# EAGLE design SparkFun_Cryptographic_Co-processor_ATECC608A (EAGLE 9.6.2)
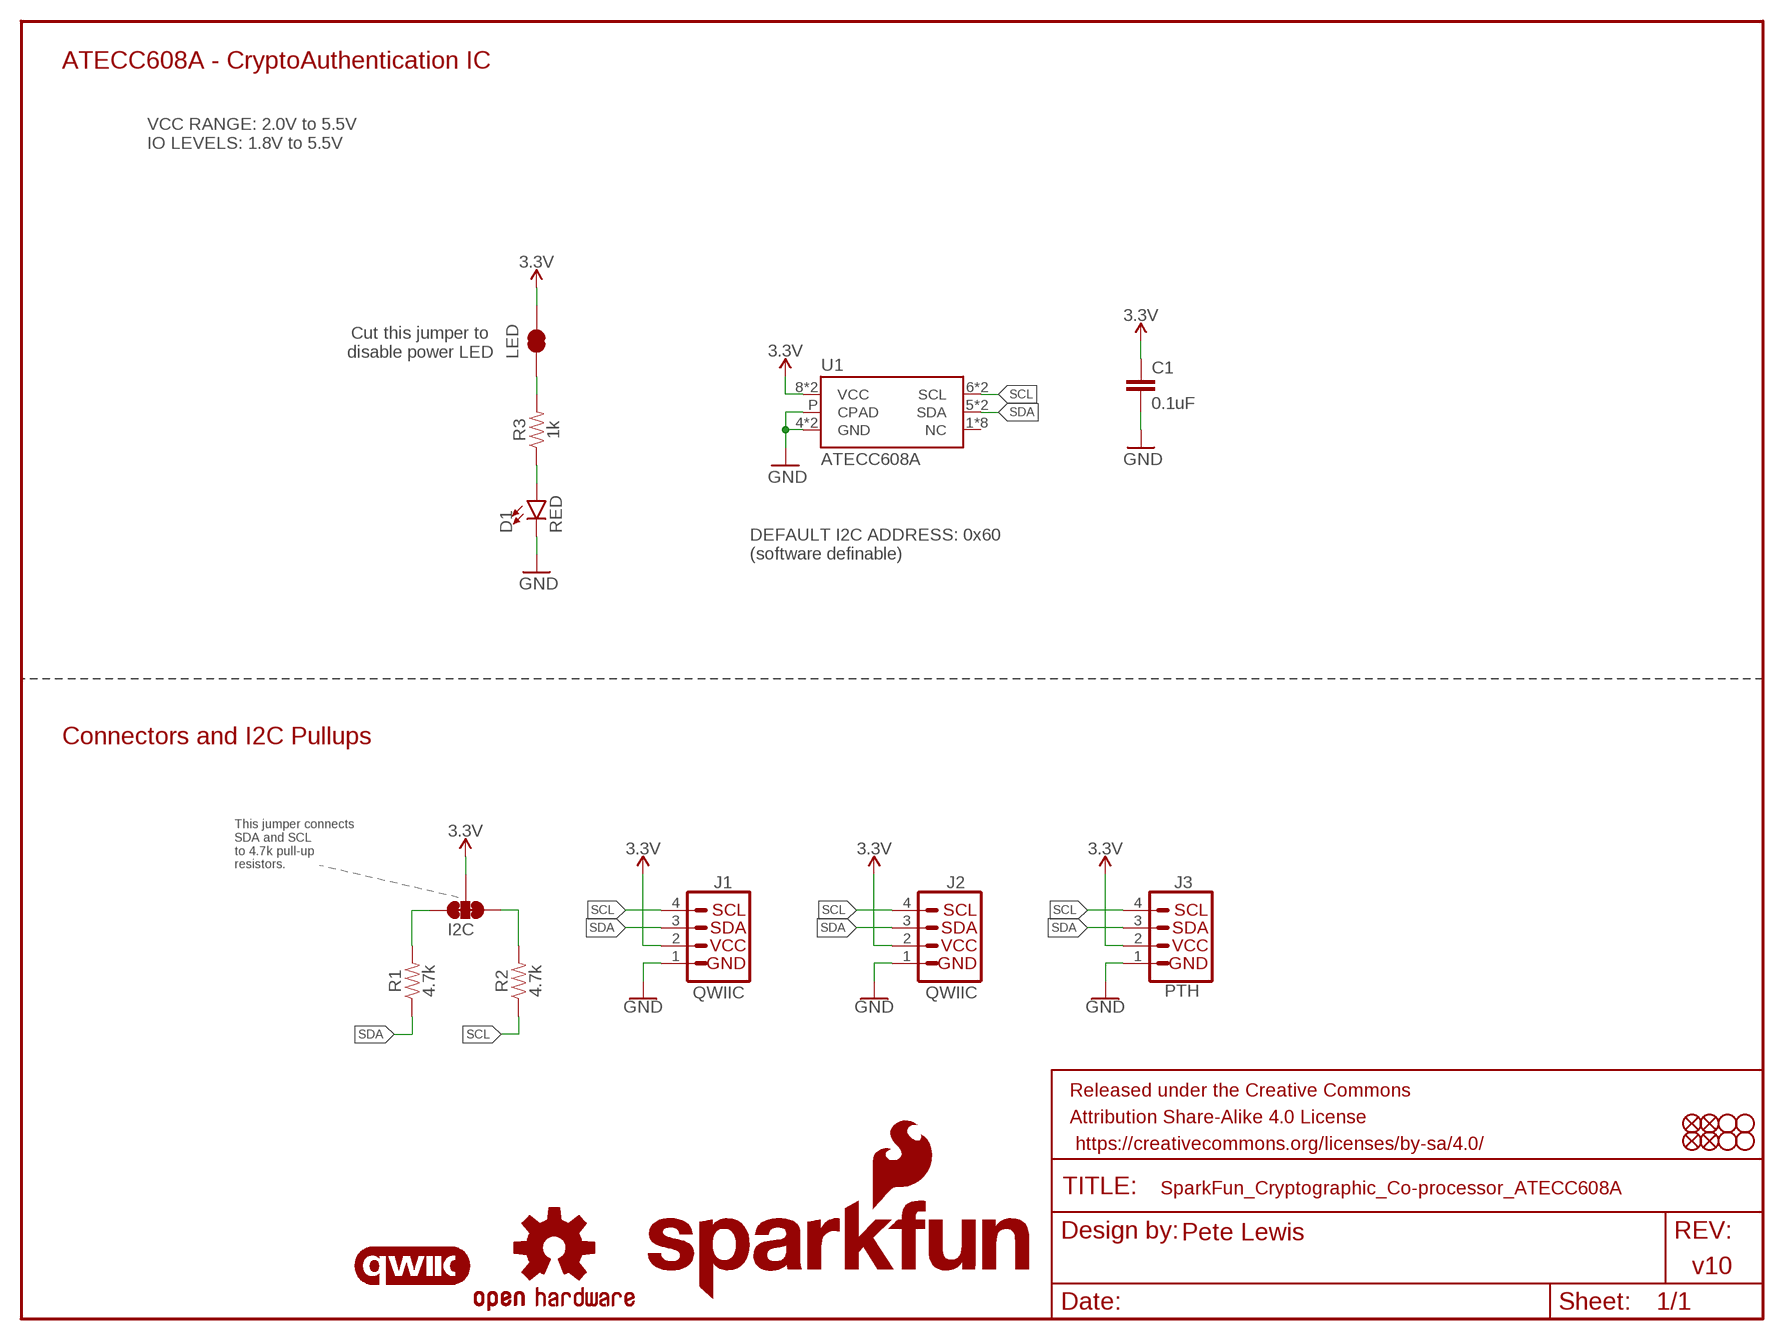
[diagram p0: schematic, sheet 1]

## Parts
C1  0.1uF  0.1UF-0603-25V-(+80/-20%)  [0603]
D1  RED  LED-RED0603  [LED-0603]
FD1  FIDUCIAL1X2  [FIDUCIAL-1X2]
FD2  FIDUCIAL1X2  [FIDUCIAL-1X2]
FD3  FIDUCIAL1X2  [FIDUCIAL-1X2]
FD4  FIDUCIAL1X2  [FIDUCIAL-1X2]
FRAME1  FRAME-LETTER  [CREATIVE_COMMONS]
H1  STAND-OFF  [STAND-OFF]
H2  STAND-OFF  [STAND-OFF]
H3  STAND-OFF  [STAND-OFF]
H4  STAND-OFF  [STAND-OFF]
I2C  JUMPER-SMT_3_2-NC_TRACE_SILK  [SMT-JUMPER_3_2-NC_TRACE_SILK]
J1  QWIIC  I2C_STANDARDQWIIC  [JST04_1MM_RA]
J2  QWIIC  I2C_STANDARDQWIIC  [JST04_1MM_RA]
J3  PTH  I2C_STANDARD_NO_SILK  [1X04_NO_SILK]
LED  JUMPER-SMT_2_NC_TRACE_SILK  [SMT-JUMPER_2_NC_TRACE_SILK]
LOGO1  SFE_LOGO_NAME_FLAME.1_INCH  [SFE_LOGO_NAME_FLAME_.1]
LOGO3  QWIIC_LOGO_4MM  [QWIIC_4MM]
LOGO4  OSHW-LOGOS  [OSHW-LOGO-S]
R1  4.7k  4.7KOHM-0603-1/10W-1%  [0603]
R2  4.7k  4.7KOHM-0603-1/10W-1%  [0603]
R3  1k  1KOHM-0603-1/10W-1%  [0603]
U1  ATECC608A  ATECC608ADUAL_PACKAGE_UDFN_SOIC-8  [DUAL_UDFN_2X3MM_SOIC-8]

## Nets
3.3V: C1.1 I2C.2 J1.2 J2.2 J3.2 LED.2 U1.8(VCC) U1.8S(VCC)
GND: C1.2 D1.C J1.1 J2.1 J3.1 U1.4(GND) U1.4S(GND) U1.P(CPAD)
N$3: D1.A R3.1
N$4: I2C.3 R1.2
N$5: I2C.1 R2.2
N$7: LED.1 R3.2
SCL: J1.4 J2.4 J3.4 R2.1 U1.6(SCL) U1.6S(SCL)
SDA: J1.3 J2.3 J3.3 R1.1 U1.5(SDA) U1.5S(SDA)
Unconnected: U1.1(NC) U1.1S(NC) U1.2(NC) U1.2S(NC) U1.3(NC) U1.3S(NC) U1.7(NC) U1.7S(NC)

## Notes on the sheet
- ATECC608A - CryptoAuthentication IC
- VCC RANGE: 2.0V to 5.5V
  IO LEVELS: 1.8V to 5.5V
- Cut this jumper to 
  disable power LED
- DEFAULT I2C ADDRESS: 0x60
  (software definable)
- Connectors and I2C Pullups
- This jumper connects 
  SDA and SCL 
  to 4.7k pull-up 
  resistors.
- Pete Lewis
- v10

## Library data of the parts
C1 = SparkFun-Capacitors:0.1UF: 0.1µF ceramic capacitors A capacitor is a passive two-terminal electrical component used to store electrical energy temporarily in an electric field.; PROD_ID: CAP-00810
D1 = SparkFun-LED:LED-RED: Red SMD LED Used in manufacturing of most products at SparkFun Packages: 0603 - SMD 0603 package [Product Link] <http://docs.avagotech.com/docs/AV02-0551EN> 0603 SMART - SMD 0603 SMART package ( more efficient and expensive)[Product Link] <http://www.osram-os.com/Graphics/XPic2/00077099_0.pdf> 1206 - SMD1206 package [Product Link] <https://www.sparkfun.com/datasheets/DevTools/LilyPad/Q150OVS4.pdff> SparkFun Products: Pro Mini 328 -5V <https://www.sparkfun.com/products/821> RedBoard <https://www.sparkfun.com/products/12757> IOIO-OTG <https://www.sparkfun.com/products/13613>; PROD_ID: DIO-00819
FD1-FD4 = SparkFun-Aesthetics:FIDUCIAL: Fiducial Alignment Points Point-of-reference for pick-and-place machines and other optical instruments.
FRAME1 = SparkFun-Aesthetics:FRAME-LETTER: Schematic Frame - Letter Standard 8.5x11 US Letter frame
H1-H4 = SparkFun-Hardware:STAND-OFF: Stand Off Drill holes for mechanically mounting via screws, standoffs, etc. Note: Use the keepout ring to avoid running the screw head into surrounding components. Variant Overviews STAND-OFF - Mechanical footprint for a #4 phillips button head screw. STAND-OFF-TIGHT - Mechanical footprint for a #4 phillips button head screw, Example SparkFun Products Screw - Phillips Head (1/4", 4-40, 10 pack) <https://www.sparkfun.com/products/10453> (PRT-10453) Screw - Phillips Head (1/2", 4-40, 10 pack) <https://www.sparkfun.com/products/10452> (PRT-10452) Screw - Phillips Head (3/4", 4-40, 10 pack) <https://www.sparkfun.com/products/10451> (PRT-10451) Screw - Phillips Head (1", 4-40, 10 pack) <https://www.sparkfun.com/products/10450> (PRT-10450)
I2C = SparkFun-Jumpers:JUMPER-SMT_3_2-NC_TRACE: Normally closed trace jumper (2 of 2 connections) This jumper has a trace between all three pads so they are normally closed (NC). Use a razor knife to open the connection(s). For best results follow the IPC guidelines for cutting traces: Cutout at least 0.063 mm (0.005 in). Remove all loose material to clean up the cut area. Seal the cut with an approved epoxy. Reapply solder to reclose the connection(s).
J1 J2 = SparkFun-Connectors:I2C_STANDARD: SparkFun I2C Standard Pinout Header SparkFun has standardized on a pinout for all I2C based sensor breakouts. This pinout allows I2C boards to be plugged directly into the headers on Arduino Uno compatible boards, and to be daisy chained easily. Example SparkFun Products: SparkFun Atmospheric Sensor Breakout - BME280 <https://www.sparkfun.com/products/13676> SparkFun Altitude/Pressure Sensor Breakout - MPL3115A2 <https://www.sparkfun.com/products/11084> SparkFun TOF Range Finder Sensor - VL6180 <https://www.sparkfun.com/products/12785>; PROD_ID: CONN-13694; VALUE: Qwiic Right Angle
J3 = SparkFun-Connectors:I2C_STANDARD: SparkFun I2C Standard Pinout Header SparkFun has standardized on a pinout for all I2C based sensor breakouts. This pinout allows I2C boards to be plugged directly into the headers on Arduino Uno compatible boards, and to be daisy chained easily. Example SparkFun Products: SparkFun Atmospheric Sensor Breakout - BME280 <https://www.sparkfun.com/products/13676> SparkFun Altitude/Pressure Sensor Breakout - MPL3115A2 <https://www.sparkfun.com/products/11084> SparkFun TOF Range Finder Sensor - VL6180 <https://www.sparkfun.com/products/12785>
LED = SparkFun-Jumpers:JUMPER-SMT_2_NC_TRACE: Normally closed trace jumper This jumper has a trace between two pads so it's normally closed (NC). Use a razor knife to open the connection. For best results follow the IPC guidelines for cutting traces: Cutout at least 0.063 mm (0.005 in). Remove all loose material to clean up the cut area. Seal the cut with an approved epoxy. Reapply solder to reclose the connection.
LOGO1 = SparkFun-Aesthetics:SFE_LOGO_NAME_FLAME: SparkFun Font Logo w/ Flame This is the SparkFun full logo. The logo on the schematic will always be the same size; the package variant is the height of the flame part of the logo. Default layer for the logo on the board is tSilk.
LOGO3 = SparkFun-Aesthetics:QWIIC_LOGO: Qwiic Logos for placement on schematic and PCB. The 5.5mm silk logo is best for placing next to Qwiic connector.
LOGO4 = SparkFun-Aesthetics:OSHW-LOGO: Open-Source Hardware (OSHW) Logo This logo indicates the piece of hardware it is found on incorporates a OSHW license and/or adheres to the definition of open source hardware found here: http://freedomdefined.org/OSHW
R1 R2 = SparkFun-Resistors:4.7KOHM: 4.7kΩ resistor A resistor is a passive two-terminal electrical component that implements electrical resistance as a circuit element. Resistors act to reduce current flow, and, at the same time, act to lower voltage levels within circuits. - Wikipedia; PROD_ID: RES-07857
R3 = SparkFun-Resistors:1KOHM: 1kΩ resistor A resistor is a passive two-terminal electrical component that implements electrical resistance as a circuit element. Resistors act to reduce current flow, and, at the same time, act to lower voltage levels within circuits. - Wikipedia; PROD_ID: RES-07856
U1 = SparkFun-IC-Special-Function:ATECC608A: ATECC608A CryptoAuthentication Device Cryptographic Co-processor with Secure Hardware-Based Key Storage ECDSA: FIPS186-3 Elliptic Curve Digital Signature Algorithm ECDH: FIPS SP800-56A Elliptic Curve Diffie-Hellman Algorithm AES Algorithm for encryption and decryption NIST Standard P256 Elliptic Curve Support SHA-256 Hash Algorithm with HMAC Option 1 MHz Standard I2C Interface 2.0V to 5.5V Supply Voltage Range 1.8V to 5.5V IO levels Datasheet (summary) <http://ww1.microchip.com/downloads/en/DeviceDoc/ATECC608A-CryptoAuthentication-Device-Summary-Data-Sheet-DS40001977B.pdf> SparkFun Products SparkFun Cryptographic Co-Processor Breakout - ATECC608A (Qwiic) <https://www.sparkfun.com/products/18077> (DEV-18077); PROD_ID: IC-15951

## Board
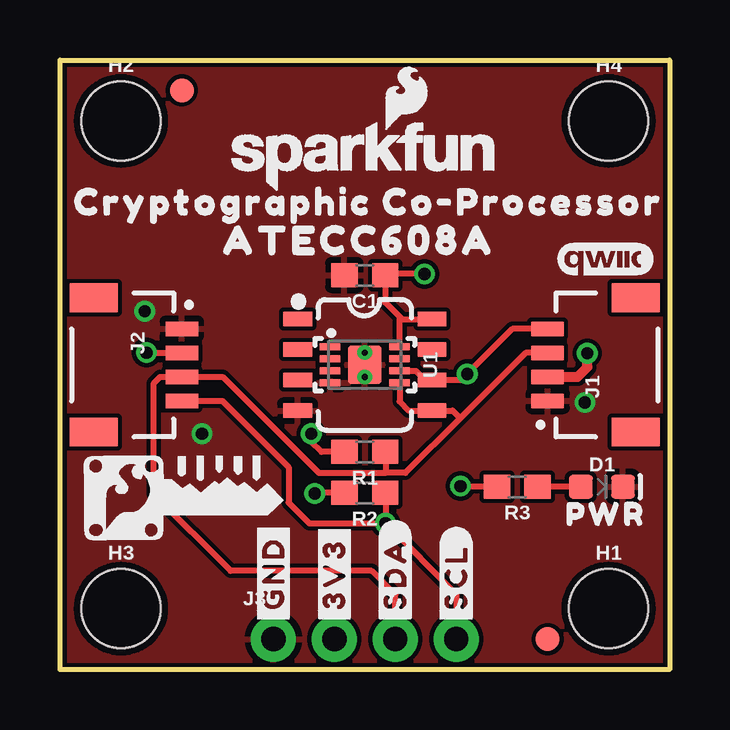
[diagram p1: board, top side]
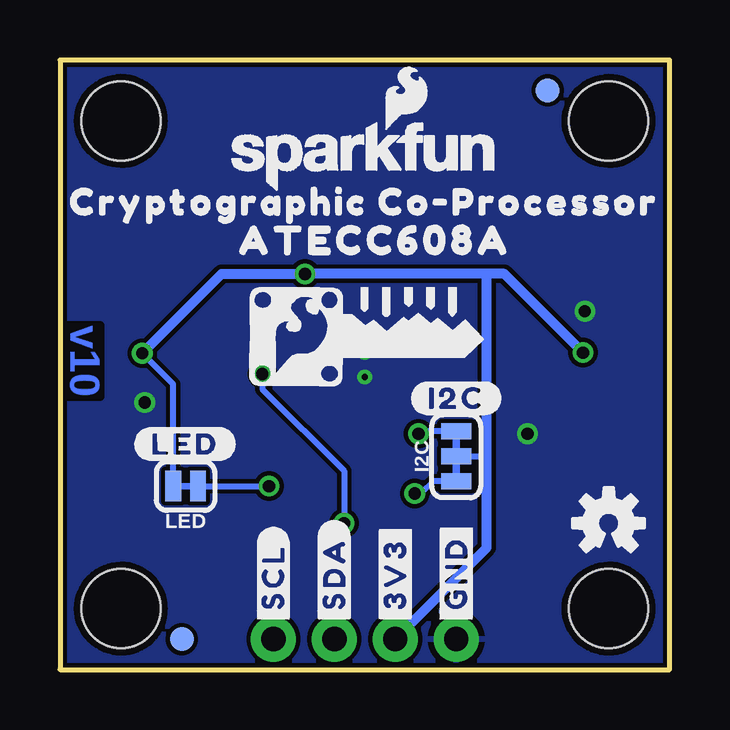
[diagram p2: board, bottom side, seen from below]

Size 25.4 x 25.4 mm. Coordinates in mm from the lower left corner, seen from the top.
Outline: 0,0 0,25.4 25.4,25.4 25.4,0 0,0
Copper layers (1*16): Top 0.035mm / dielectric 1.5mm / Bottom 0.035mm
Design rules "SparkFun-2-Layer-General-JLCPCB": minimum track width 7mil, minimum drill 0.3mm, track to track 7mil, track to pad 7mil, pad to pad 7mil, via to via 7mil, smd to smd 7mil, copper to edge 7mil, drill to drill 7mil, minimum pad ring 7mil, minimum via ring 7mil, stop-mask expansion 3mil, vias tented up to drill 25mil, thermal gap 10mil

### Footprints (pad centres in the part's own frame; a part is rotated, then mirrored left to right if it is on the bottom)
0603 = smd 1.1 x 1: 1 -0.85,0; 2 0.85,0
LED-0603 = smd 1 x 1: A -0.877,0; C 0.877,0
FIDUCIAL-1X2 = smd 1 x 1: 1 0,0
STAND-OFF = hole 3.302: 0,0
SMT-JUMPER_3_2-NC_TRACE_SILK = smd 0.66 x 1.27: 1 -1.041,0; 2 0,0; 3 1.041,0
JST04_1MM_RA = smd 0.6 x 1.35: 1 -1.5,0; 2 -0.5,0; 3 0.5,0; 4 1.5,0 | smd 1.2 x 2: NC1 2.8,-3.675; NC2 -2.8,-3.675
1X04_NO_SILK = drill 1.016 pad 1.88: 1 0,0; 2 2.54,0; 3 5.08,0; 4 7.62,0
SMT-JUMPER_2_NC_TRACE_SILK = smd 0.66 x 1.27: 1 -0.521,0; 2 0.521,0
DUAL_UDFN_2X3MM_SOIC-8 = smd 0.3 x 0.85: 1 -0.75,-1.45; 2 -0.25,-1.45; 3 0.25,-1.45; 4 0.75,-1.45; 5 0.75,1.45; 6 0.25,1.45; 7 -0.25,1.45; 8 -0.75,1.45 | smd 0.6 x 1.2: 1S -1.905,-2.8; 2S -0.635,-2.8; 3S 0.635,-2.8; 4S 1.905,-2.8; 5S 1.905,2.8; 6S 0.635,2.8; 7S -0.635,2.8; 8S -1.905,2.8 | smd 1.6 x 1.4: P 0,0

### Placement (x,y rotation side)
C1  12.7,16.43 180 top
D1  22.58,7.62 0 top
FD1  5.08,24.13 0 top
FD2  20.32,1.27 0 top
FD3  20.32,1.27 0 bottom
FD4  5.08,24.13 0 bottom
FRAME1  -13.97,-12.7 0 top  (outside the outline)
H1  22.86,2.54 0 top
H2  2.54,22.86 0 top
H3  2.54,2.54 0 top
H4  22.86,22.86 0 top
I2C  8.89,8.89 90 bottom
J1  20.32,12.7 90 top
J2  5.08,12.7 270 top
J3  8.89,1.27 0 top
LED  20.17,7.65 180 bottom
LOGO1  12.7,21.41 0 top
LOGO2  SFE_LOGO_NAME_FLAME.1_INCH  [SFE_LOGO_NAME_FLAME_.1]  12.7,21.41 0 bottom
LOGO3  22.73,17.09 0 top
LOGO4  2.54,6.1 0 bottom
R1  12.7,9.07 180 top
R2  12.7,7.37 180 top
R3  19.05,7.62 180 top
U1  12.7,12.7 270 top
U$1  [#I2C#0]  8.89,11.3 0 bottom
U$2  [#SCL#0]  16.51,1.78 90 bottom
U$3  [#LED#0]  20.19,9.4 0 bottom
U$4  [#SDA#0]  13.97,1.78 90 bottom
U$5  [ATECC608A0]  12.47,17.88 0 top
U$6  [#3V3#0]  11.43,1.78 90 bottom
U$7  [ATECC608A0]  12.27,17.88 0 bottom
U$8  [CRYPTO_COPROCESSOR_LOGO_LARGE]  12.7,13.97 0 bottom
U$9  [CRYPTOGRAPHIC_CO#PROCESSOR0]  12.85,19.48 0 top
U$10  [CRYPTO_COPROCESSOR_LOGO_SMALL]  5.21,7.11 0 top
U$11  [PWR0]  22.73,6.48 0 top
U$13  [#SCL#0]  16.51,1.78 90 top
U$17  [#SDA#0]  13.97,1.78 90 top
U$19  [CRYPTOGRAPHIC_CO#PROCESSOR0]  12.73,19.48 0 bottom
U$20  [#3V3#0]  11.43,1.78 90 top
U$21  [#GND#0]  8.89,1.78 90 top
U$23  [#GND#0]  8.89,1.78 90 bottom

### Tracks (layer width: path | path; a pad name or v marks a point on that pad's centre or on a via)
3.3V  (via drill 0.51)
  Top 0.254: v3.61,13.21 v3.62,13.2 J2.2 | v15.19,16.48 13.6,16.48 C1.1 13.55,15.3 14.15,14.7 | 14.15,14.7 14.25,14.61 U1.8S | U1.8 14.15,14.7
  Top 0.406: J1.2 21.57,12.2 21.97,12.6 v21.97,13.18
  Bottom 0.254: I2C.2 7.62,8.89 | LED.2 20.69,11.9 v21.97,13.18
  Bottom 0.406: 7.62,16.48 6.88,16.48 v3.61,13.21 | 7.62,16.48 v15.19,16.48 18.67,16.48 v21.97,13.18 | J3.2 7.62,5.08 7.62,8.89 7.62,16.48
GND  (via drill 0.25, 0.51)
  other vias: 21.87,11.13 3.53,14.94 12.7,13.21 12.7,12.19 5.92,9.83
  pour Top: 0,0 25.4,0 25.4,25.4 0,25.4
  pour Bottom: 0,25.4 25.4,25.4 25.4,0 0,0
N$3
  Top 0.254: D1.A R3.1
N$4  (via drill 0.51)
  Top 0.254: R1.2 10.9,9.07 10.46,9.5 v10.46,9.83
  Bottom 0.254: I2C.3 10.36,9.93 v10.46,9.83
N$5  (via drill 0.51)
  Top 0.254: R2.2 10.64,7.37 v10.62,7.34
  Bottom 0.254: I2C.1 9.83,7.85 10.34,7.34 v10.62,7.34
N$7  (via drill 0.51)
  Top 0.254: v16.69,7.64 18.18,7.64 R3.2
  Bottom 0.254: LED.1 v16.69,7.64
SCL  (via drill 0.51)
  Top 0.254: J1.4 18.85,14.2 v16.97,12.32 16.71,12.06 U1.6S 15.21,12.06 14.83,12.45 U1.6 | J2.4 6.76,11.2 9.53,8.43 9.53,6.96 10.39,6.1 v13.56,6.1 | R2.1 13.56,7.35 v13.56,6.1 | v13.56,6.1 16.51,3.15 J3.4
  Bottom 0.254: v13.56,6.1 13.56,8.28 16.97,11.68 v16.97,12.32
SDA
  Top 0.254: J1.3 19.4,13.2 16.68,10.48 | J3.3 13.97,3.12 12.98,4.12 7.11,4.12 3.91,7.32 3.91,11.94 4.17,12.2 J2.3 6.77,12.2 10.78,8.19 13.56,8.19 | R1.1 13.56,9.05 13.56,8.19 | 16.68,10.48 14.39,8.19 13.56,8.19 | U1.5 14.15,11.17 14.53,10.79 U1.5S 16.36,10.79 16.68,10.48

### Text on the board
Bottom: v10
Measures: UNITS: INCHES
tDocu: Pete Lewis